# EAGLE design FunctionGenerator (EAGLE 5.10)

## Sheet 1 of 5
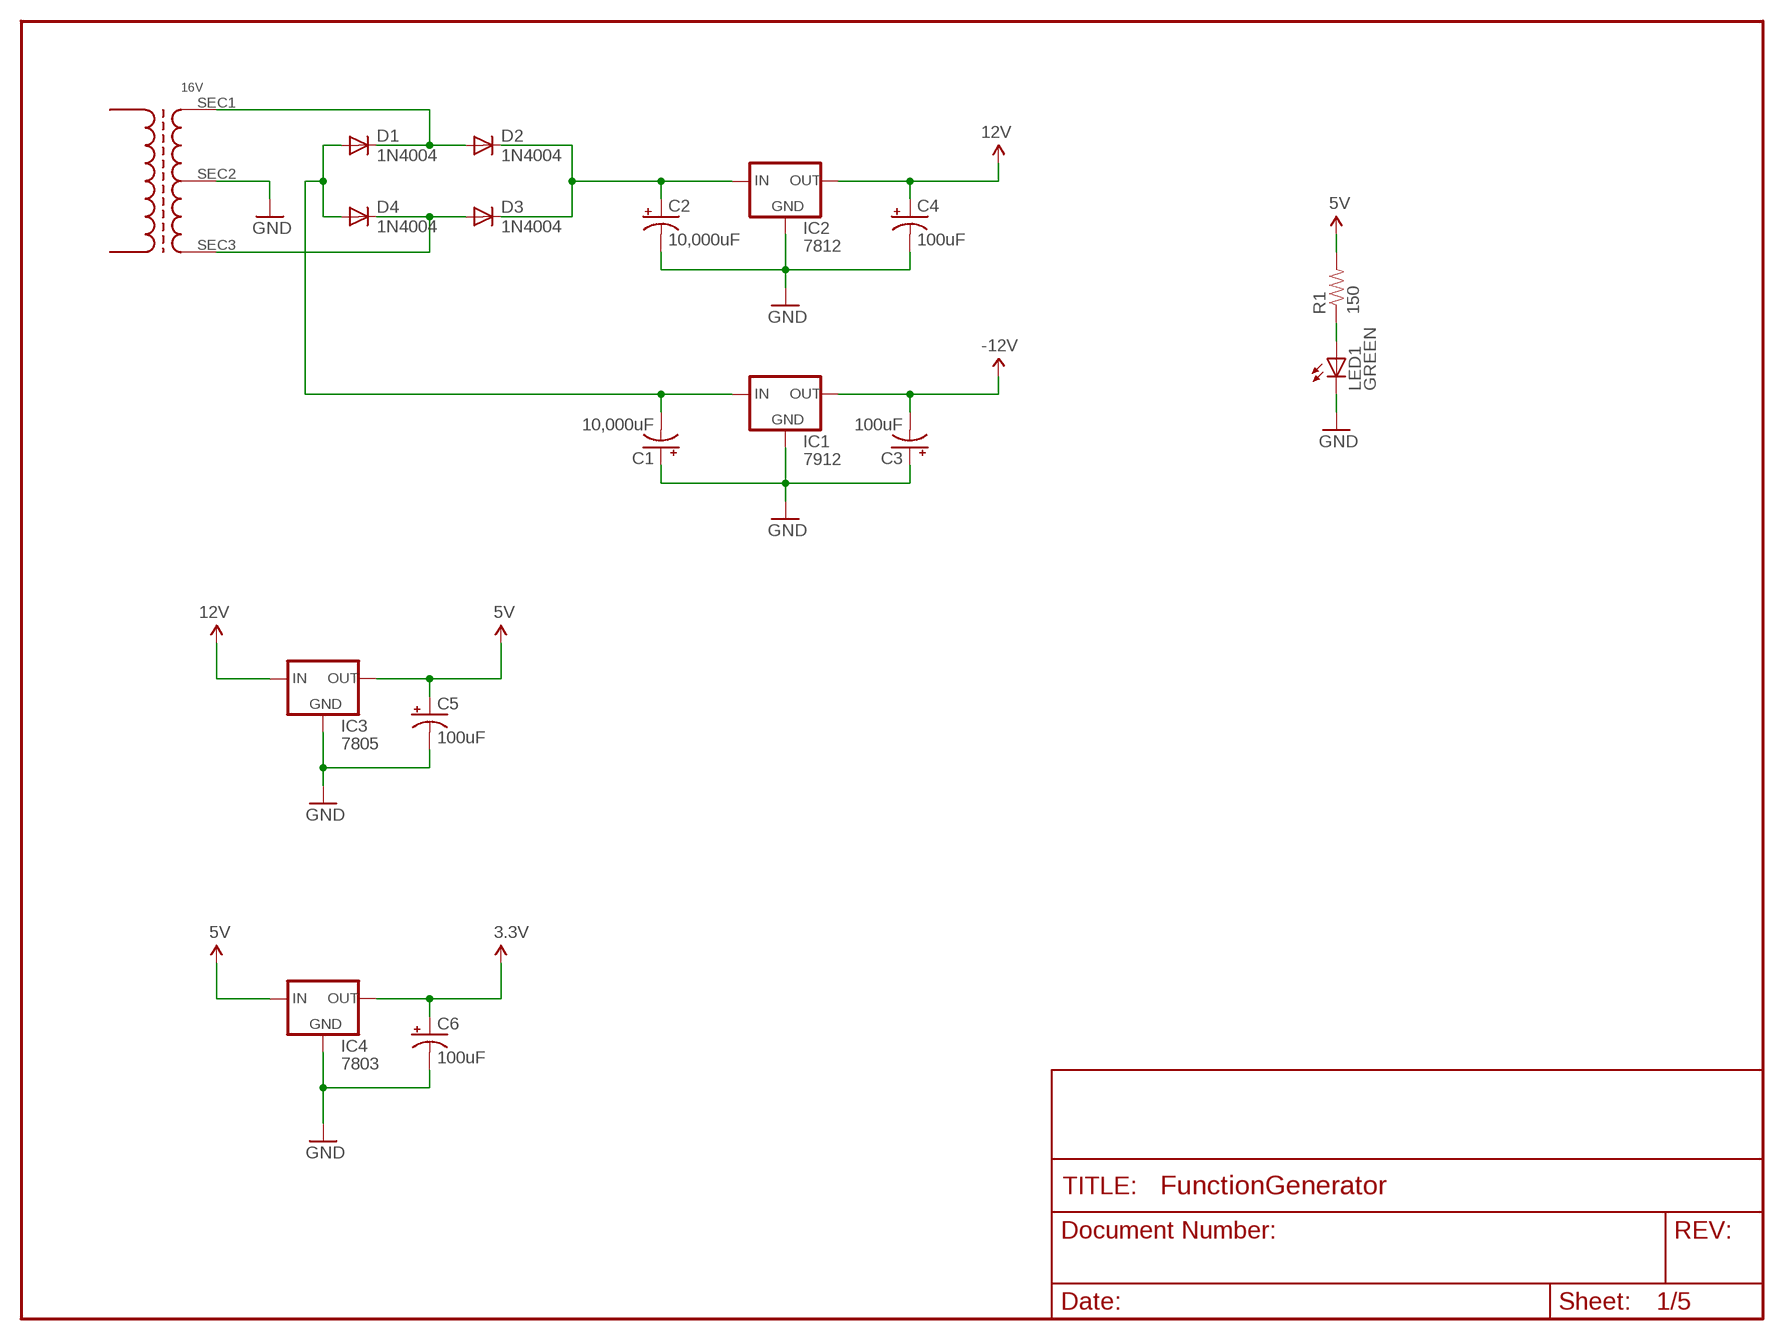
[diagram p0: schematic, sheet 1]

### Parts
C1  10,000uF  CAP_POLPTH4  [CPOL-RADIAL-1000UF-25V]
C2  10,000uF  CAP_POLPTH4  [CPOL-RADIAL-1000UF-25V]
C3  100uF  CAP_POLPTH1  [CPOL-RADIAL-100UF-25V]
C4  100uF  CAP_POLPTH1  [CPOL-RADIAL-100UF-25V]
C5  100uF  CAP_POLPTH1  [CPOL-RADIAL-100UF-25V]
C6  100uF  CAP_POLPTH1  [CPOL-RADIAL-100UF-25V]
D1  1N4004  [DO41-10]
D2  1N4004  [DO41-10]
D3  1N4004  [DO41-10]
D4  1N4004  [DO41-10]
IC1  7912  V_REG_78XXSINK  [TO220-IGO]
IC2  7812  V_REG_78XXSINK  [TO220-IGO]
IC3  7805  V_REG_78XXSINK  [TO220-IGO]
IC4  7803  V_REG_78XXSINK  [TO220-IGO]
LED1  GREEN  LED1206  [LED-1206]
R1  150  RESISTOR1206  [1206]
T1  16V  TRANSFORMER-CENTERTAP  [TRANSFORMER-CENTERTAP-WIRE]

### Nets
3.3V: C6.1(+) IC4.OUT ; also sheet 2,3,5
5V: C5.1(+) IC3.OUT IC4.IN R1.2
12V: C4.1(+) IC2.OUT IC3.IN ; also sheet 3
-12V: C3.2(-) IC1.OUT ; also sheet 3
GND: C1.1(+) C2.2(-) C3.1(+) C4.2(-) C5.2(-) C6.2(-) IC1.GND IC2.GND IC3.GND IC4.GND LED1.C T1.SEC2 ; also sheet 2,3,4,5
N$1: C1.2(-) D1.A D4.A IC1.IN
N$2: D1.C D2.A T1.SEC1
N$3: D3.A D4.C T1.SEC3
N$4: C2.1(+) D2.C D3.C IC2.IN
N$6: LED1.A R1.1

## Sheet 2 of 5
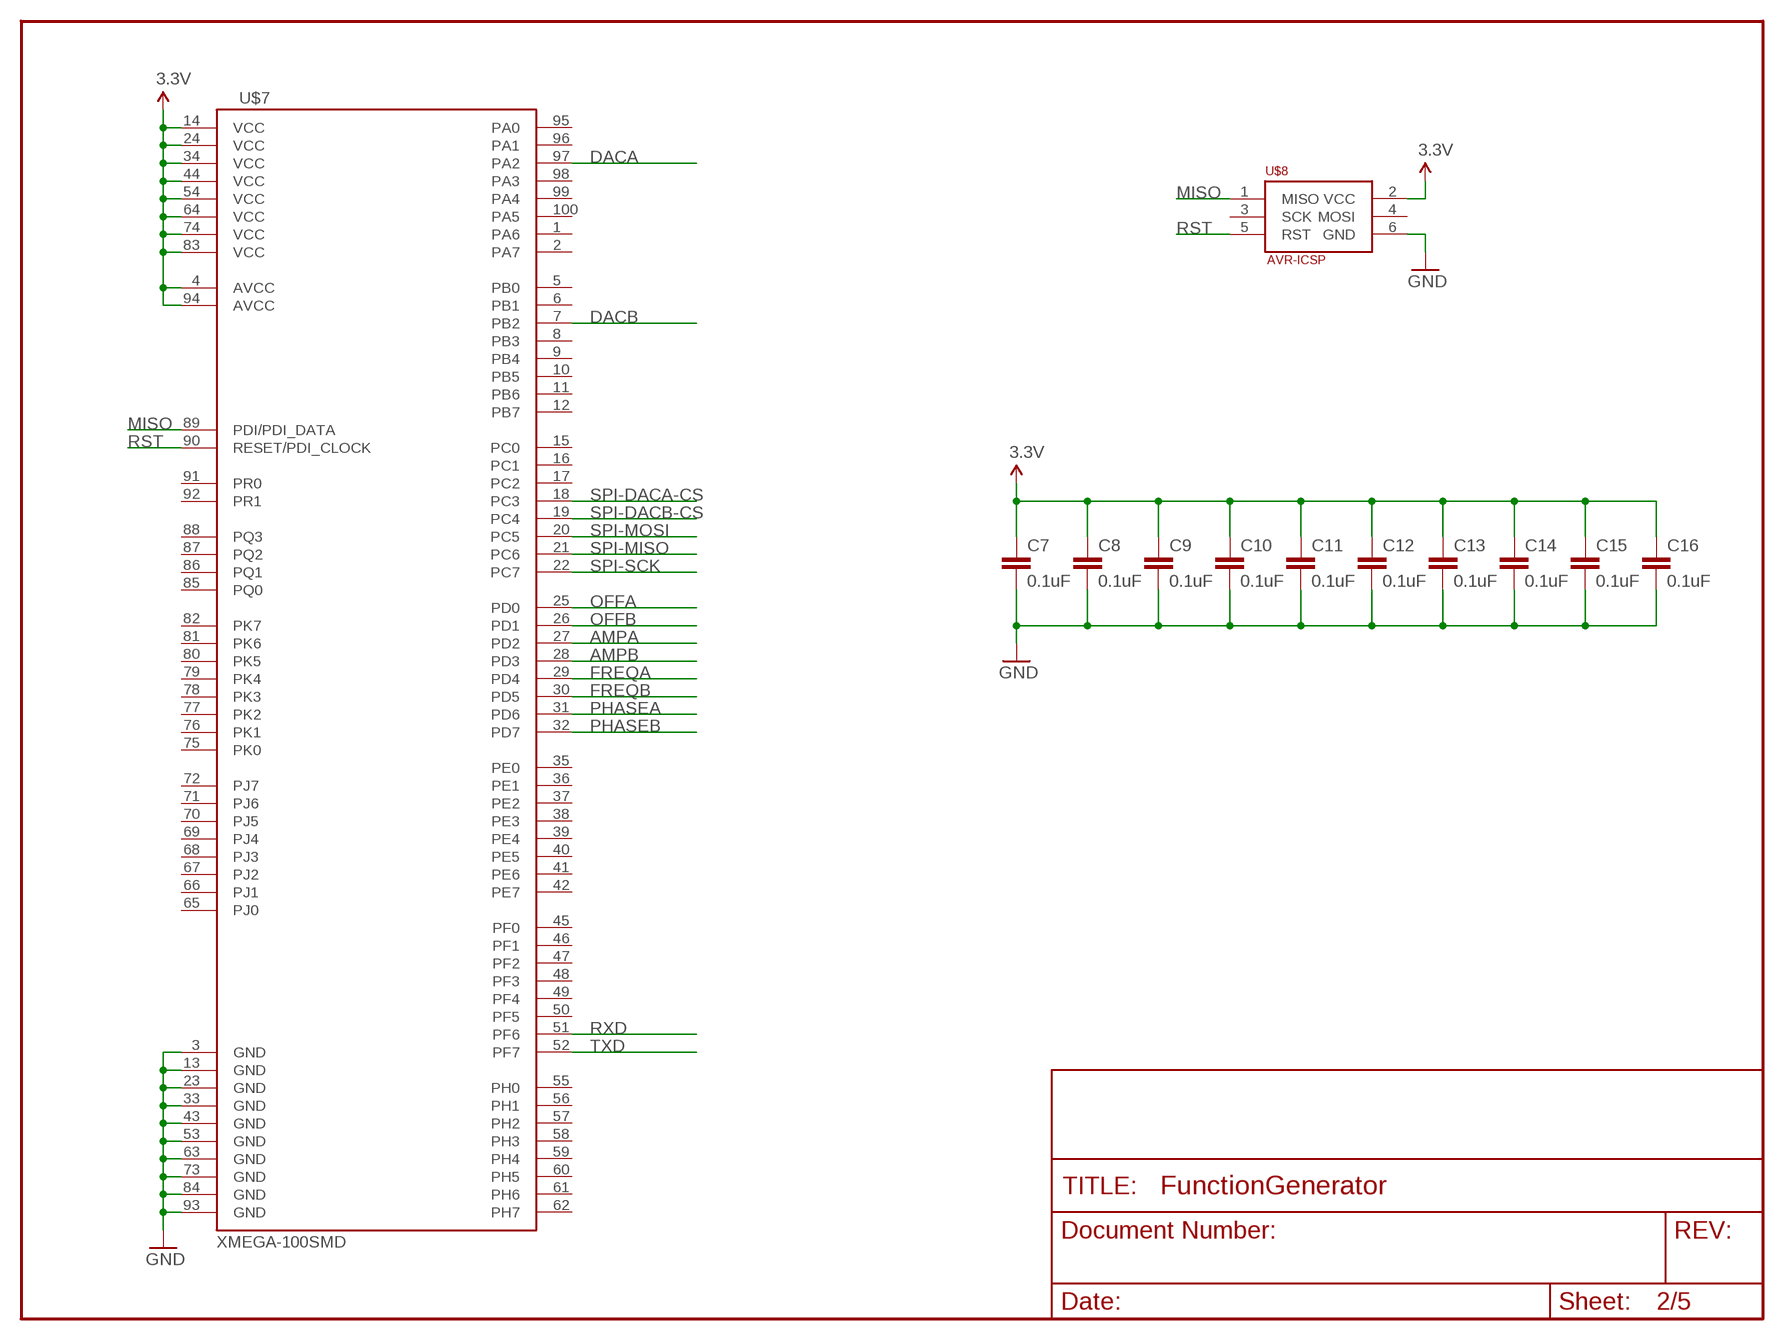
[diagram p1: schematic, sheet 2]

### Parts
C7  0.1uF  CAP0805  [0805]
C8  0.1uF  CAP0805  [0805]
C9  0.1uF  CAP0805  [0805]
C10  0.1uF  CAP0805  [0805]
C11  0.1uF  CAP0805  [0805]
C12  0.1uF  CAP0805  [0805]
C13  0.1uF  CAP0805  [0805]
C14  0.1uF  CAP0805  [0805]
C15  0.1uF  CAP0805  [0805]
C16  0.1uF  CAP0805  [0805]
U$7  XMEGA-100SMD  [TQFP-100-14X14MM]
U$8  AVR-ICSP  [AVR-ICSP]

### Nets
3.3V: C7.1 C8.1 C9.1 C10.1 C11.1 C12.1 C13.1 C14.1 C15.1 C16.1 U$7.4(AVCC) U$7.14(VCC) U$7.24(VCC) U$7.34(VCC) U$7.44(VCC) U$7.54(VCC) U$7.64(VCC) U$7.74(VCC) U$7.83(VCC) U$7.94(AVCC) U$8.2(VCC) ; also sheet 1,3,5
AMPA: U$7.27(PD2) ; also sheet 5
AMPB: U$7.28(PD3) ; also sheet 5
DACA: U$7.97(PA2) ; also sheet 3
DACB: U$7.7(PB2) ; also sheet 3
FREQA: U$7.29(PD4) ; also sheet 5
FREQB: U$7.30(PD5) ; also sheet 5
GND: C7.2 C8.2 C9.2 C10.2 C11.2 C12.2 C13.2 C14.2 C15.2 C16.2 U$7.3(GND) U$7.13(GND) U$7.23(GND) U$7.33(GND) U$7.43(GND) U$7.53(GND) U$7.63(GND) U$7.73(GND) U$7.84(GND) U$7.93(GND) U$8.6(GND) ; also sheet 1,3,4,5
MISO: U$7.89(PDI/PDI_DATA) U$8.1(MISO)
OFFA: U$7.25(PD0) ; also sheet 5
OFFB: U$7.26(PD1) ; also sheet 5
PHASEA: U$7.31(PD6) ; also sheet 5
PHASEB: U$7.32(PD7) ; also sheet 5
RST: U$7.90(RESET/PDI_CLOCK) U$8.5(RST)
RXD: U$7.51(PF6) ; also sheet 4
SPI-DACA-CS: U$7.18(PC3) ; also sheet 3
SPI-DACB-CS: U$7.19(PC4) ; also sheet 3
SPI-MISO: U$7.21(PC6) ; also sheet 3
SPI-MOSI: U$7.20(PC5) ; also sheet 3
SPI-SCK: U$7.22(PC7) ; also sheet 3
TXD: U$7.52(PF7) ; also sheet 4
Unconnected: U$7.1(PA6) U$7.2(PA7) U$7.5(PB0) U$7.6(PB1) U$7.8(PB3) U$7.9(PB4) U$7.10(PB5) U$7.11(PB6) U$7.12(PB7) U$7.15(PC0) U$7.16(PC1) U$7.17(PC2) U$7.35(PE0) U$7.36(PE1) U$7.37(PE2) U$7.38(PE3) U$7.39(PE4) U$7.40(PE5) U$7.41(PE6) U$7.42(PE7) U$7.45(PF0) U$7.46(PF1) U$7.47(PF2) U$7.48(PF3) U$7.49(PF4) U$7.50(PF5) U$7.55(PH0) U$7.56(PH1) U$7.57(PH2) U$7.58(PH3) U$7.59(PH4) U$7.60(PH5) U$7.61(PH6) U$7.62(PH7) U$7.65(PJ0) U$7.66(PJ1) U$7.67(PJ2) U$7.68(PJ3) U$7.69(PJ4) U$7.70(PJ5) U$7.71(PJ6) U$7.72(PJ7) U$7.75(PK0) U$7.76(PK1) U$7.77(PK2) U$7.78(PK3) U$7.79(PK4) U$7.80(PK5) U$7.81(PK6) U$7.82(PK7) U$7.85(PQ0) U$7.86(PQ1) U$7.87(PQ2) U$7.88(PQ3) U$7.91(PR0) U$7.92(PR1) U$7.95(PA0) U$7.96(PA1) U$7.98(PA3) U$7.99(PA4) U$7.100(PA5) U$8.3(SCK) U$8.4(MOSI)

## Sheet 3 of 5
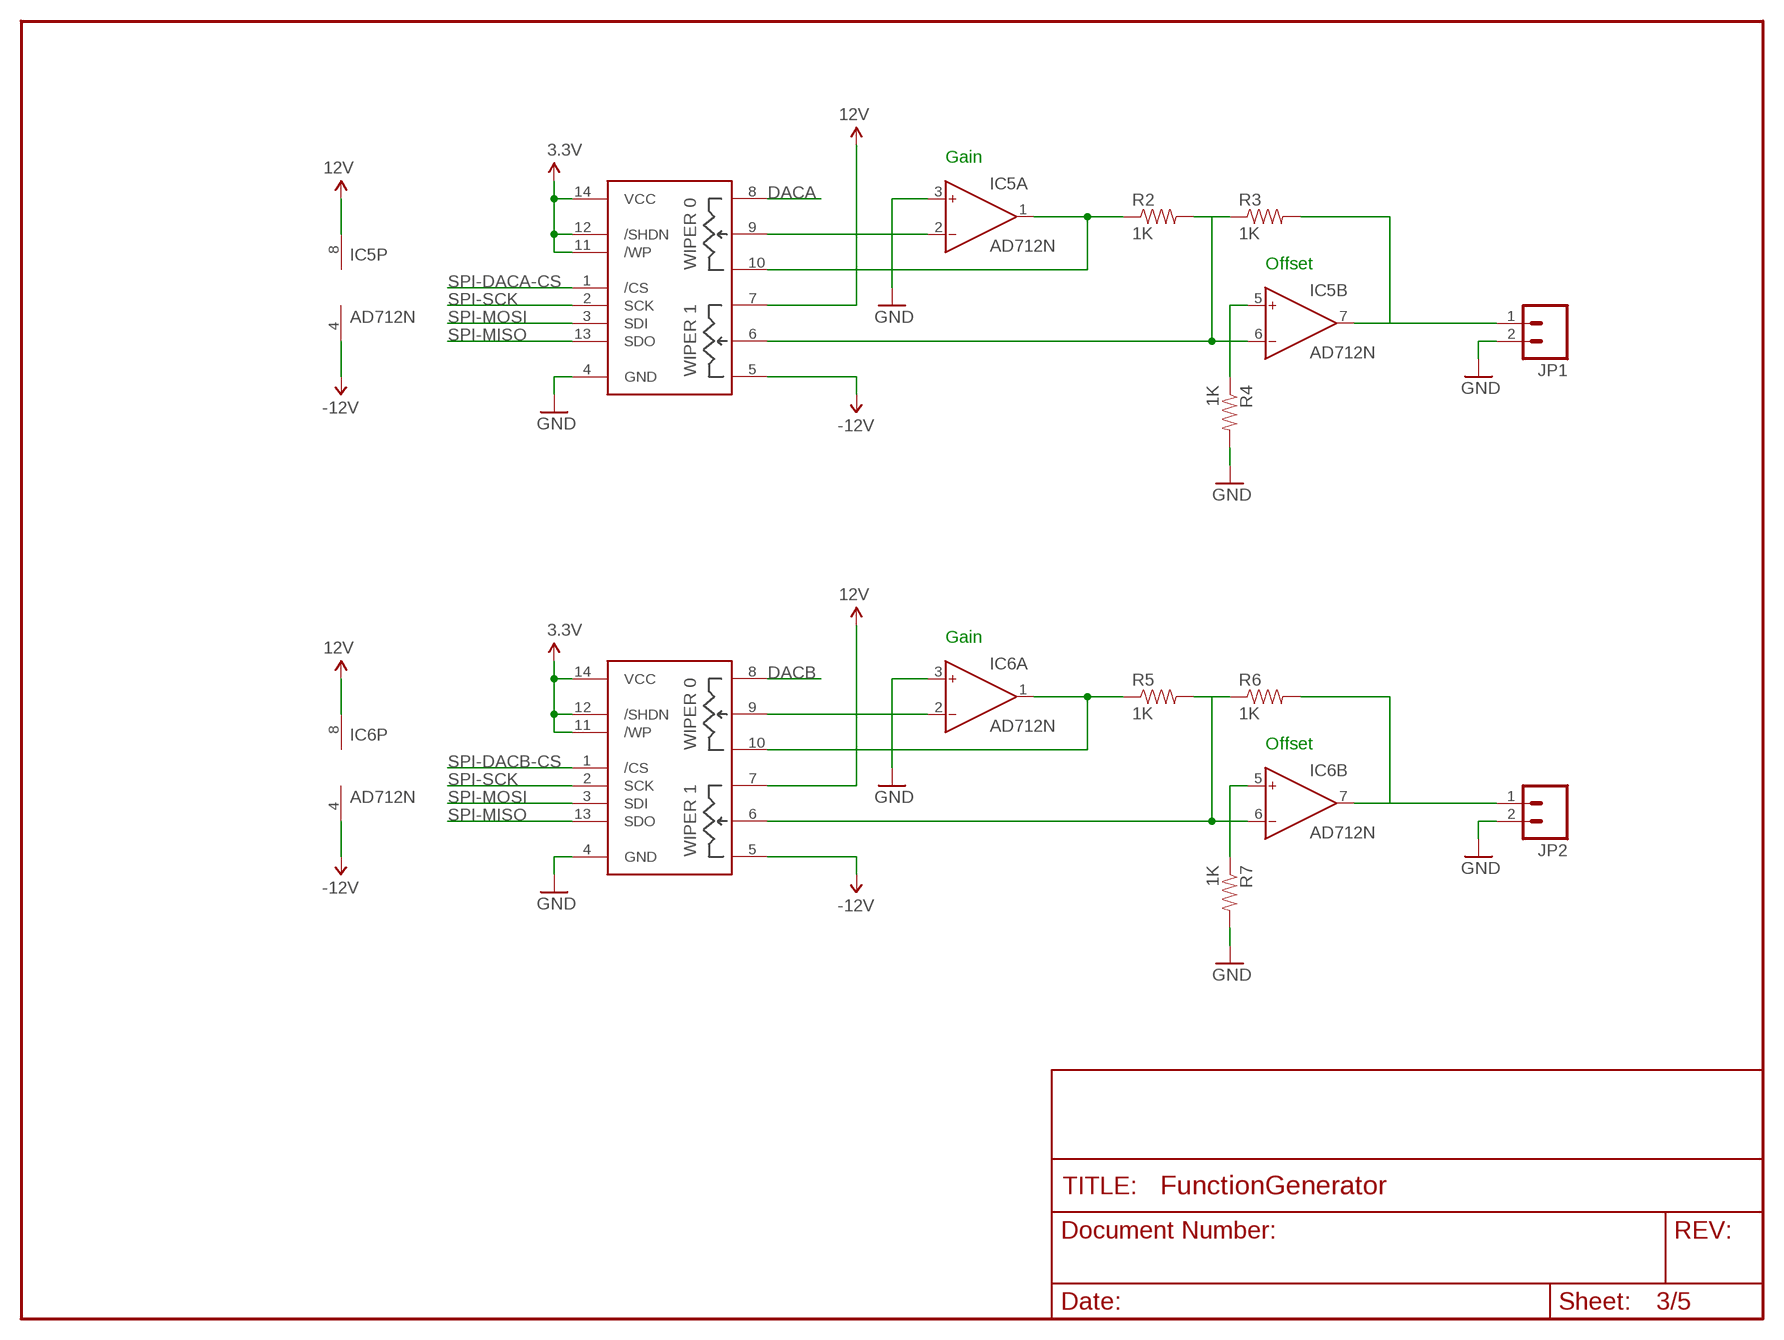
[diagram p2: schematic, sheet 3]

### Parts
IC5  AD712N  [DIL08]
IC6  AD712N  [DIL08]
JP1  M02PTH  [1X02]
JP2  M02PTH  [1X02]
R2  1K  RESISTOR1206  [1206]
R3  1K  RESISTOR1206  [1206]
R4  1K  RESISTOR1206  [1206]
R5  1K  RESISTOR1206  [1206]
R6  1K  RESISTOR1206  [1206]
R7  1K  RESISTOR1206  [1206]
U1  MCP42X1  [DIL14]
U2  MCP42X1  [DIL14]

### Nets
3.3V: U1.11(/WP) U1.12(/SHDN) U1.14(VCC) U2.11(/WP) U2.12(/SHDN) U2.14(VCC) ; also sheet 1,2,5
12V: IC5.8(P:V+) IC6.8(P:V+) U1.7(P1A) U2.7(P1A) ; also sheet 1
-12V: IC5.4(P:V-) IC6.4(P:V-) U1.5(P1B) U2.5(P1B) ; also sheet 1
DACA: U1.8(P0A) ; also sheet 2
DACB: U2.8(P0A) ; also sheet 2
GND: IC5.3(A:IN+) IC6.3(A:IN+) JP1.2 JP2.2 R4.2 R7.2 U1.4(GND) U2.4(GND) ; also sheet 1,2,4,5
N$7: IC5.2(A:IN-) U1.9(P0W)
N$8: IC5.6(B:IN-) R2.2 R3.1 U1.6(P1W)
N$9: IC5.1(A:OUT) R2.1 U1.10(P0B)
N$10: IC6.2(A:IN-) U2.9(P0W)
N$11: IC6.1(A:OUT) R5.1 U2.10(P0B)
N$12: R3.2
N$13: IC5.7(B:OUT) JP1.1
N$14: IC5.5(B:IN+) R4.1
N$15: IC6.6(B:IN-) R5.2 R6.1 U2.6(P1W)
N$16: R6.2
N$17: IC6.7(B:OUT) JP2.1
N$18: IC6.5(B:IN+) R7.1
SPI-DACA-CS: U1.1(/CS) ; also sheet 2
SPI-DACB-CS: U2.1(/CS) ; also sheet 2
SPI-MISO: U1.13(SDO) U2.13(SDO) ; also sheet 2
SPI-MOSI: U1.3(SDI) U2.3(SDI) ; also sheet 2
SPI-SCK: U1.2(SCK) U2.2(SCK) ; also sheet 2

### Notes on the sheet
- Gain
- Offset
- Gain
- Offset

## Sheet 4 of 5
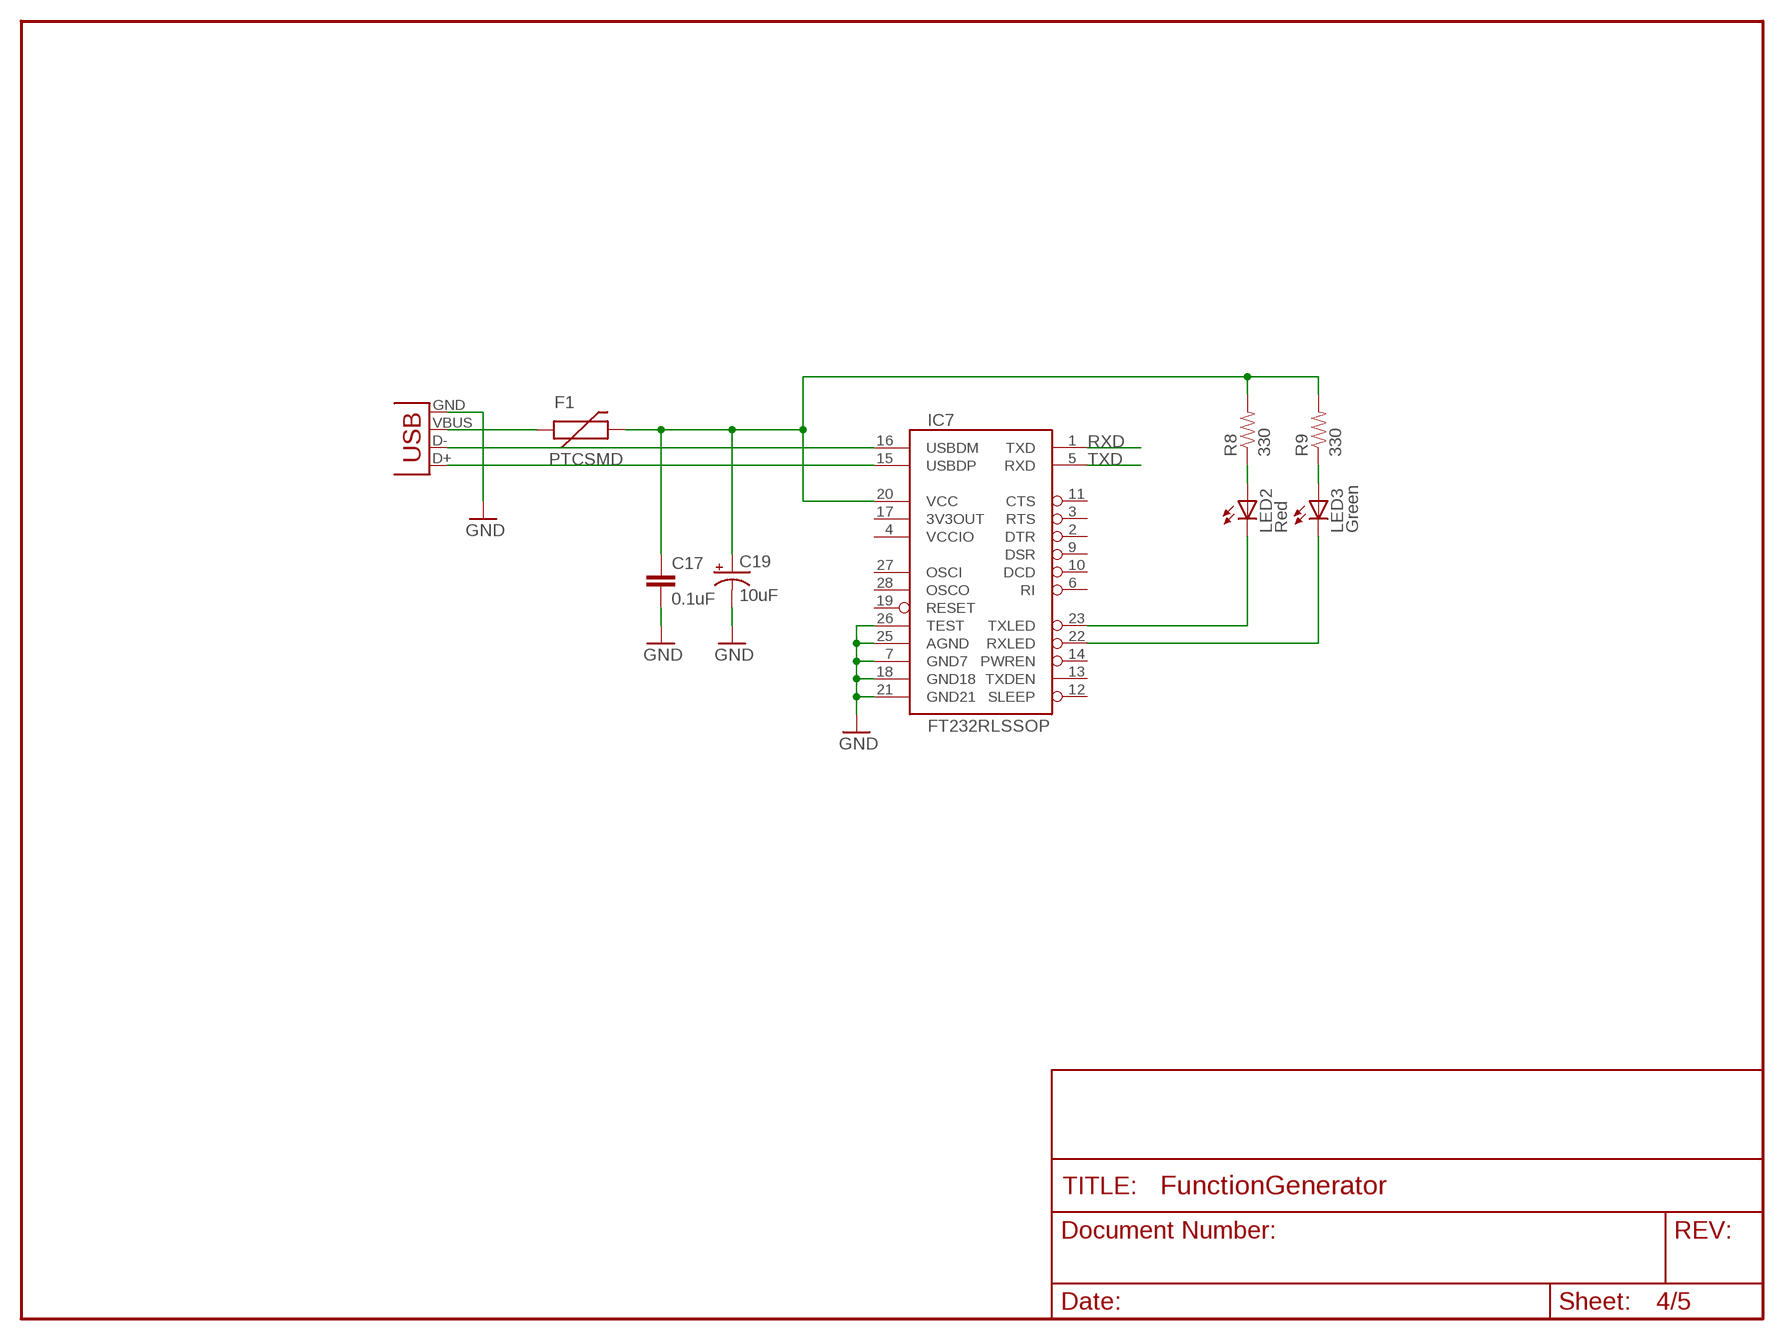
[diagram p3: schematic, sheet 4]

### Parts
C17  0.1uF  CAP1206  [1206]
C19  10uF  CAP_POL1206  [EIA3216]
F1  PTCSMD  [PTC-1206]
IC7  FT232RLSSOP  [SSOP28DB]
LED2  Red  LED1206  [LED-1206]
LED3  Green  LED1206  [LED-1206]
R8  330  RESISTOR1206  [1206]
R9  330  RESISTOR1206  [1206]
X1  USBSMD  [USB-MINIB]

### Nets
GND: C17.2 C19.C(-) IC7.7(GND7) IC7.18(GND18) IC7.21(GND21) IC7.25(AGND) IC7.26(TEST) X1.GND ; also sheet 1,2,3,5
N$5: F1.1 X1.VBUS
N$19: IC7.16(USBDM) X1.D-
N$20: IC7.15(USBDP) X1.D+
N$21: C17.1 C19.A(+) F1.2 IC7.20(VCC) R8.2 R9.2
N$22: LED2.A R8.1
N$23: LED3.A R9.1
N$24: IC7.23(TXLED) LED2.C
N$25: IC7.22(RXLED) LED3.C
RXD: IC7.1(TXD) ; also sheet 2
TXD: IC7.5(RXD) ; also sheet 2
Unconnected: IC7.2(DTR) IC7.3(RTS) IC7.6(RI) IC7.9(DSR) IC7.10(DCD) IC7.11(CTS) IC7.12(SLEEP) IC7.13(TXDEN) IC7.14(PWREN) IC7.17(3V3OUT) IC7.19(RESET) IC7.27(OSCI) IC7.28(OSCO)

## Sheet 5 of 5
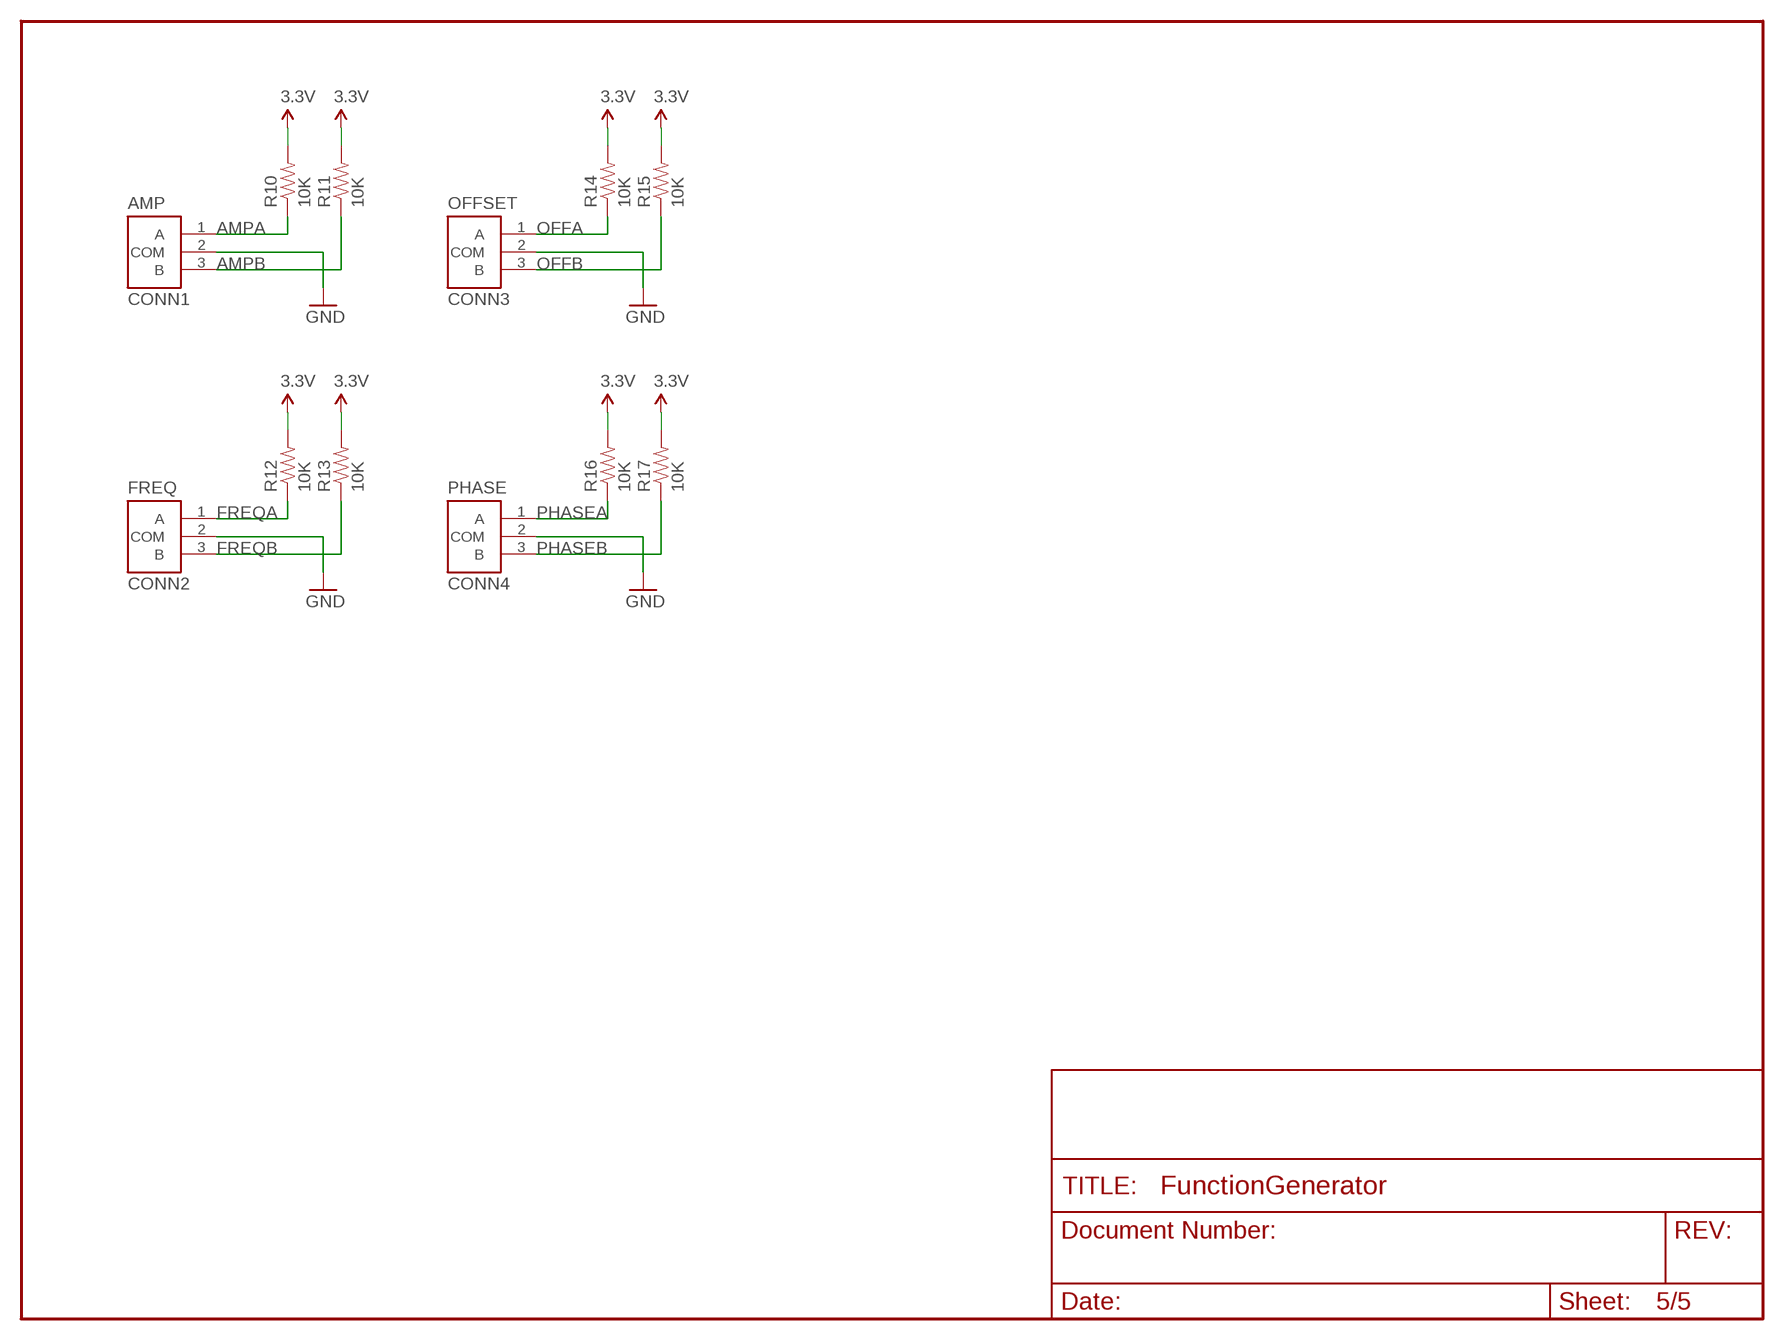
[diagram p4: schematic, sheet 5]

### Parts
CONN1  AMP  ENCODER  [1X03]
CONN2  FREQ  ENCODER  [1X03]
CONN3  OFFSET  ENCODER  [1X03]
CONN4  PHASE  ENCODER  [1X03]
R10  10K  RESISTOR1206  [1206]
R11  10K  RESISTOR1206  [1206]
R12  10K  RESISTOR1206  [1206]
R13  10K  RESISTOR1206  [1206]
R14  10K  RESISTOR1206  [1206]
R15  10K  RESISTOR1206  [1206]
R16  10K  RESISTOR1206  [1206]
R17  10K  RESISTOR1206  [1206]

### Nets
3.3V: R10.2 R11.2 R12.2 R13.2 R14.2 R15.2 R16.2 R17.2 ; also sheet 1,2,3
AMPA: CONN1.1(A) R10.1 ; also sheet 2
AMPB: CONN1.3(B) R11.1 ; also sheet 2
FREQA: CONN2.1(A) R12.1 ; also sheet 2
FREQB: CONN2.3(B) R13.1 ; also sheet 2
GND: CONN1.2(COM) CONN2.2(COM) CONN3.2(COM) CONN4.2(COM) ; also sheet 1,2,3,4
OFFA: CONN3.1(A) R14.1 ; also sheet 2
OFFB: CONN3.3(B) R15.1 ; also sheet 2
PHASEA: CONN4.1(A) R16.1 ; also sheet 2
PHASEB: CONN4.3(B) R17.1 ; also sheet 2

## Power pins joined to a net without a drawn wire
VCCIO: IC7.4(VCCIO)

## Library data of the parts
C1-C6 C19 = SparkFun:CAP_POL: Capacitor Polarized These are standard SMD and PTH capacitors. Normally 10uF, 47uF, and 100uF in electrolytic and tantalum varieties. Always verify the external diameter of the through hole cap, it varies with capacity, voltage, and manufacturer. The EIA devices should be standard.
C7-C17 = SparkFun:CAP: Capacitor Standard 0603 ceramic capacitor, and 0.1" leaded capacitor.
CONN1-CONN4 = FiveVolt:ENCODER: Rotary Encoder
D1-D4 = diode:1N4004: DIODE general purpose rectifier, 1 A
F1 = SparkFun:PTC: Resettable Fuse PTC Resettable Fuse. Spark Fun Electronics SKU : COM-08357
IC1-IC4 = SparkFun:V_REG_78XX: Voltage Regulator Standard 7805 5V regulator. IGO (Input Ground Output). Spark Fun Electronics SKU : COM-00107
IC5 IC6 = analog-devices:AD712: Dual Precision, Low Cost, High Speed BiFET Op Amp Source: http://www.analog.com/static/imported-files/data_sheets/AD712.pdf
IC7 = SparkFun:FT232RL: USB UART FT232RL 4th Generation USB UART (USB <-> Serial) Controller. Spark Fun Electronics SKU : COM-00650
JP1 JP2 = SparkFun:M02: Header 2 Standard 2-pin 0.1" header. Use with straight break away headers (SKU : PRT-00116), right angle break away headers (PRT-00553), swiss pins (PRT-00743), machine pins (PRT-00117), and female headers (PRT-00115). Molex polarized connector foot print use with SKU : PRT-08233 with associated crimp pins and housings.
LED1-LED3 = SparkFun:LED: LEDs Standard schematic elements and footprints for 5mm, 3mm, 1206, and 0603 sized LEDs. 5mm - Spark Fun Electronics SKU : COM-00529 (and others)
R1-R17 = SparkFun:RESISTOR: Resistor Basic schematic elements and footprints for 0603, 1206, and PTH 1/10th watt (small) resistors.
T1 = FiveVolt:TRANSFORMER-CENTERTAP
U1 U2 = FiveVolt:MCP42X1: Dual Potentiometers
U$7 = SparkFun:XMEGA-100
U$8 = FiveVolt:AVR-ICSP
X1 = SparkFun:USB: USB Connectors USB-B-PTH is fully proven SKU : PRT-00139 USB-miniB is fully proven SKU : PRT-00587 USB-A-PCB is untested. USB-A-H is throughly reviewed, but untested. Spark Fun Electronics SKU : PRT-00437 USB-B-SMT is throughly reviewed, but untested. Needs silkscreen touching up. USB-A-S has not been used/tested USB-MB-H has not been used/tested

## Board
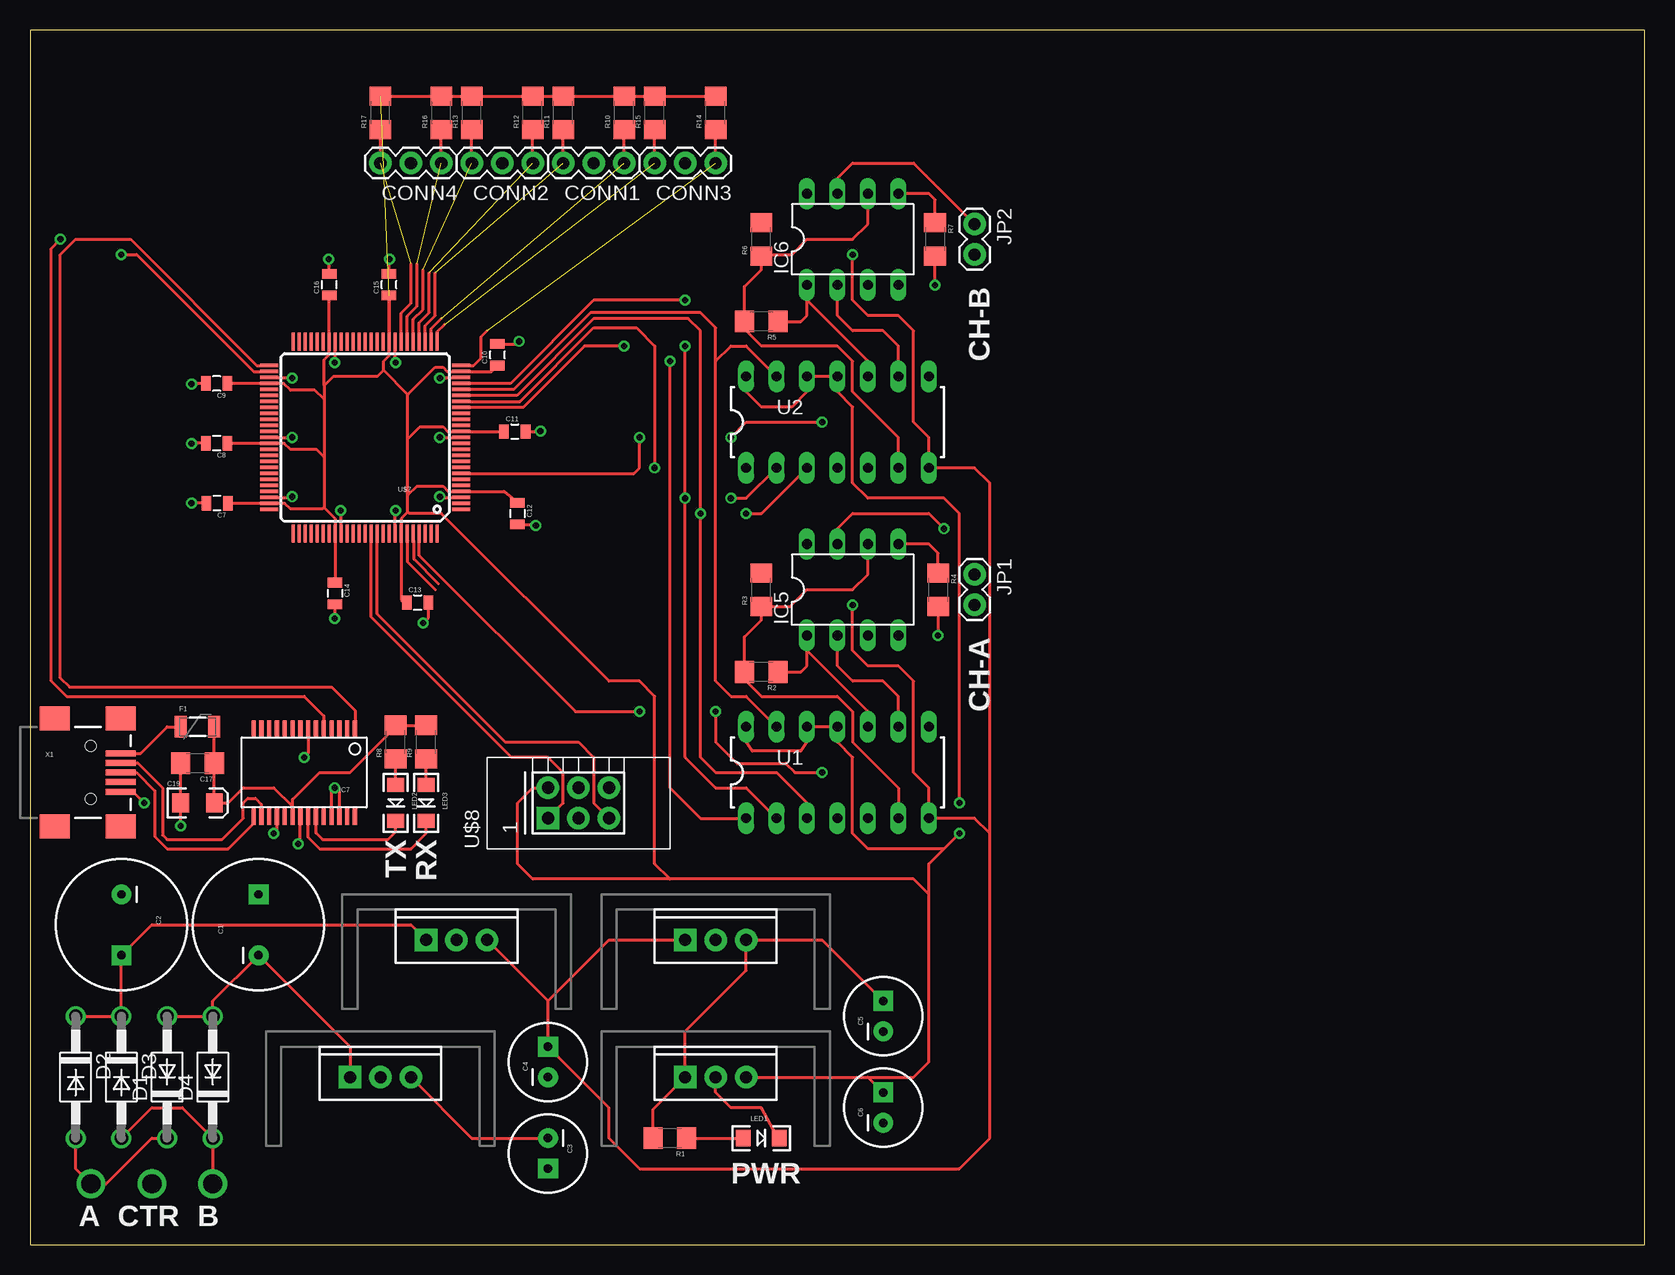
[diagram p5: board, top side]
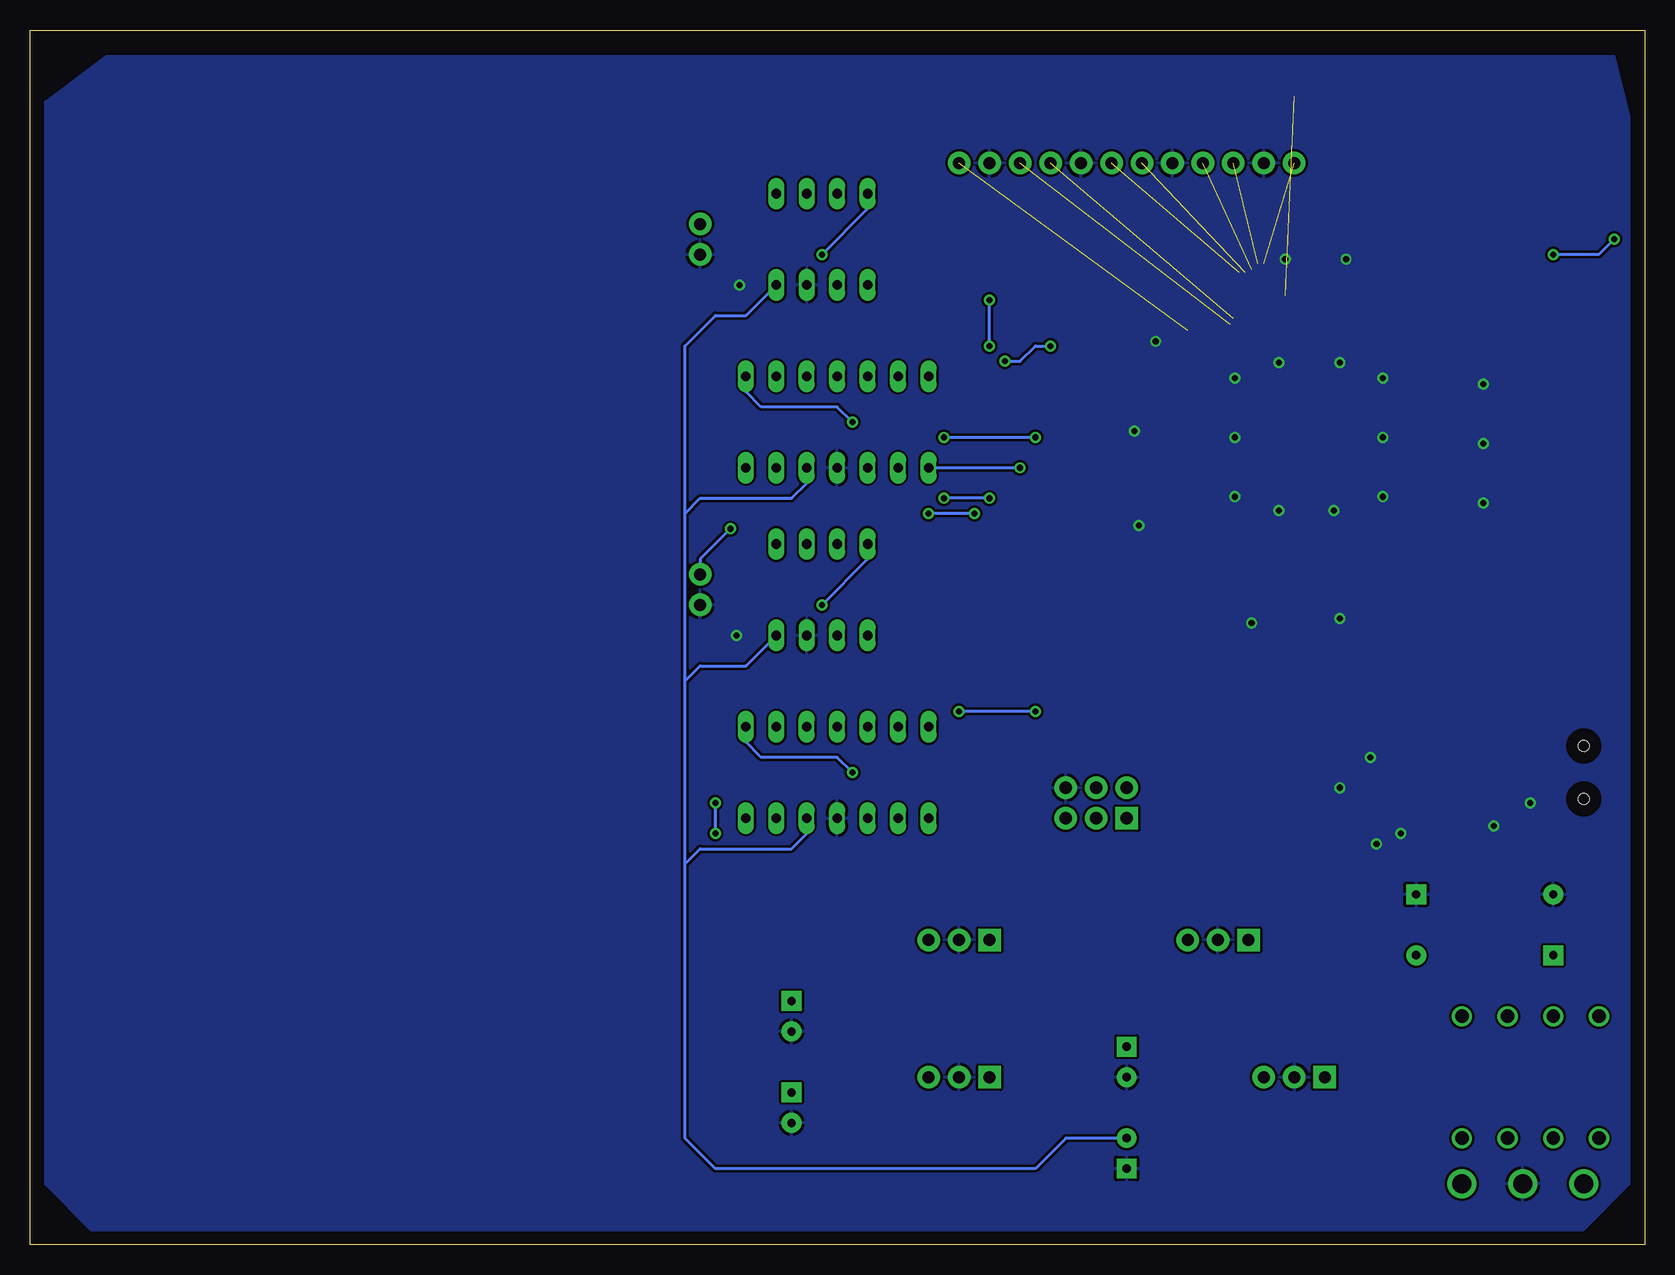
[diagram p6: board, bottom side, seen from below]

Size 134.6 x 101.27 mm. Coordinates in mm from the lower left corner, seen from the top.
Outline: 0,0 134.6,0 134.6,101.27 0,101.27 0,0
Copper layers (1*16): Top 0.035mm / dielectric 1.5mm / Bottom 0.035mm
Design rules "default": minimum track width 10mil, minimum drill 24mil, track to track 8mil, track to pad 8mil, pad to pad 8mil, via to via 8mil, smd to smd 8mil, copper to edge 40mil, drill to drill 8mil, minimum pad ring 10mil, minimum via ring 8mil, stop-mask expansion 4mil, vias tented up to drill 0mil, thermal gap 10mil

### Footprints (pad centres in the part's own frame; a part is rotated, then mirrored left to right if it is on the bottom)
CPOL-RADIAL-1000UF-25V = drill 0.7 pad 1.651 square: 1 2.54,0 | drill 0.7 pad 1.651 round: 2 -2.54,0
CPOL-RADIAL-100UF-25V = drill 0.7 pad 1.651 square: 1 1.27,0 | drill 0.7 pad 1.651 round: 2 -1.27,0
0805 = smd 0.8 x 1.2: 1 -0.9,0; 2 0.9,0
1206 = smd 1.6 x 1.8: 1 -1.4,0; 2 1.4,0
EIA3216 = smd 1.4 x 1.6: A 1.4,0; C -1.4,0
1X03 = drill 1.016 pad 1.88 round: 1 -2.54,0; 2 0,0; 3 2.54,0
DO41-10 = drill 1.118 round: A 5.08,0; C -5.08,0
PTC-1206 = smd 1 x 1.8: 1 -1.4,0; 2 1.4,0
TO220-IGO = drill 1 pad 1.88 round: GND 0,0; OUT 2.54,0 | drill 1 pad 1.88 square: IN -2.54,0
DIL08 = drill 0.813 long: 1 -3.81,-3.81; 2 -1.27,-3.81; 3 1.27,-3.81; 4 3.81,-3.81; 5 3.81,3.81; 6 1.27,3.81; 7 -1.27,3.81; 8 -3.81,3.81
SSOP28DB = smd 0.348 x 1.397: 1 -4.225,-3.656; 2 -3.575,-3.656; 3 -2.925,-3.656; 4 -2.275,-3.656; 5 -1.625,-3.656; 6 -0.975,-3.656; 7 -0.325,-3.656; 8 0.325,-3.656; 9 0.975,-3.656; 10 1.625,-3.656; 11 2.275,-3.656; 12 2.925,-3.656; 13 3.575,-3.656; 14 4.225,-3.656; 15 4.225,3.656; 16 3.575,3.656; 17 2.925,3.656; 18 2.275,3.656; 19 1.625,3.656; 20 0.975,3.656; 21 0.325,3.656; 22 -0.325,3.656; 23 -0.975,3.656; 24 -1.625,3.656; 25 -2.275,3.656; 26 -2.925,3.656; 27 -3.575,3.656; 28 -4.225,3.656
1X02 = drill 1.016 pad 1.88 round: 1 0,0; 2 2.54,0
LED-1206 = smd 1.2 x 1.4: A -1.5,0; C 1.5,0
TRANSFORMER-CENTERTAP-WIRE = drill 1.6 round: SEC1 0,5.08; SEC2 0,0; SEC3 0,-5.08
DIL14 = drill 0.813 long: 1 -7.62,-3.81; 2 -5.08,-3.81; 3 -2.54,-3.81; 4 0,-3.81; 5 2.54,-3.81; 6 5.08,-3.81; 7 7.62,-3.81; 8 7.62,3.81; 9 5.08,3.81; 10 2.54,3.81; 11 0,3.81; 12 -2.54,3.81; 13 -5.08,3.81; 14 -7.62,3.81
TQFP-100-14X14MM = smd 1.5 x 0.27: 1 -8,6; 2 -8,5.5; 3 -8,5; 4 -8,4.5; 5 -8,4; 6 -8,3.5; 7 -8,3; 8 -8,2.5; 9 -8,2; 10 -8,1.5; 11 -8,1; 12 -8,0.5; 13 -8,0; 14 -8,-0.5; 15 -8,-1; 16 -8,-1.5; 17 -8,-2; 18 -8,-2.5; 19 -8,-3; 20 -8,-3.5; 21 -8,-4; 22 -8,-4.5; 23 -8,-5; 24 -8,-5.5; 25 -8,-6; 51 8,-6; 52 8,-5.5; 53 8,-5; 54 8,-4.5; 55 8,-4; 56 8,-3.5; 57 8,-3; 58 8,-2.5; 59 8,-2; 60 8,-1.5; 61 8,-1; 62 8,-0.5; 63 8,0; 64 8,0.5; 65 8,1; 66 8,1.5; 67 8,2; 68 8,2.5; 69 8,3; 70 8,3.5; 71 8,4; 72 8,4.5; 73 8,5; 74 8,5.5; 75 8,6 | smd 0.27 x 1.5: 26 -6,-8; 27 -5.5,-8; 28 -5,-8; 29 -4.5,-8; 30 -4,-8; 31 -3.5,-8; 32 -3,-8; 33 -2.5,-8; 34 -2,-8; 35 -1.5,-8; 36 -1,-8; 37 -0.5,-8; 38 0,-8; 39 0.5,-8; 40 1,-8; 41 1.5,-8; 42 2,-8; 43 2.5,-8; 44 3,-8; 45 3.5,-8; 46 4,-8; 47 4.5,-8; 48 5,-8; 49 5.5,-8; 50 6,-8; 76 6,8; 77 5.5,8; 78 5,8; 79 4.5,8; 80 4,8; 81 3.5,8; 82 3,8; 83 2.5,8; 84 2,8; 85 1.5,8; 86 1,8; 87 0.5,8; 88 0,8; 89 -0.5,8; 90 -1,8; 91 -1.5,8; 92 -2,8; 93 -2.5,8; 94 -3,8; 95 -3.5,8; 96 -4,8; 97 -4.5,8; 98 -5,8; 99 -5.5,8; 100 -6,8
AVR-ICSP = drill 1.016 pad 1.88 square: 1 -1.27,2.54 | drill 1.016 pad 1.88 round: 2 1.27,2.54; 3 -1.27,0; 4 1.27,0; 5 -1.27,-2.54; 6 1.27,-2.54
USB-MINIB = smd 2.5 x 0.5: D+ 2.5,0; D- 2.5,0.8; GND 2.5,-1.6; ID 2.5,-0.8; VBUS 2.5,1.6 | smd 2.5 x 2: GND@1 -3,-4.5; GND@2 -3,4.5; GND@3 2.5,4.5; GND@4 2.5,-4.5 | hole 0.9: 0,2.2; 0,-2.2

### Placement (x,y rotation side)
C1  19.05,26.67 90 top
C2  7.62,26.67 270 top
C3  43.18,7.62 270 top
C4  43.18,15.24 90 top
C5  71.12,19.05 90 top
C6  71.12,11.43 90 top
C7  15.6,61.82 180 top
C8  15.57,66.83 180 top
C9  15.57,71.81 180 top
C10  38.96,74.19 90 top
C11  40.41,67.79 0 top
C12  40.64,60.96 270 top
C13  32.31,53.54 0 top
C14  25.43,54.31 270 top
C15  29.92,80.04 90 top
C16  24.94,80.04 90 top
C17  13.97,40.13 180 top
C19  13.97,36.83 0 top
CONN1  46.99,90.17 180 top
CONN2  39.37,90.17 180 top
CONN3  54.61,90.17 180 top
CONN4  31.75,90.17 180 top
D1  11.43,13.97 90 top
D2  3.81,13.97 270 top
D3  7.62,13.97 270 top
D4  15.24,13.97 90 top
F1  13.97,43.18 0 top
IC1  29.21,13.97 0 top
IC2  35.56,25.4 0 top
IC3  57.15,25.4 0 top
IC4  57.15,13.97 0 top
IC5  68.58,54.61 0 top
IC6  68.58,83.82 0 top
IC7  22.86,39.37 180 top
JP1  78.74,55.88 270 top
JP2  78.74,85.09 270 top
LED1  60.96,8.89 0 top
LED2  30.48,36.83 270 top
LED3  33.02,36.83 270 top
R1  53.34,8.89 180 top
R2  60.96,47.75 180 top
R3  60.96,54.61 90 top
R4  75.69,54.61 270 top
R5  60.96,76.96 180 top
R6  60.96,83.82 90 top
R7  75.44,83.82 270 top
R8  30.48,41.91 90 top
R9  33.02,41.91 90 top
R10  49.53,94.36 90 top
R11  44.45,94.36 90 top
R12  41.91,94.36 90 top
R13  36.83,94.36 90 top
R14  57.15,94.36 90 top
R15  52.07,94.36 90 top
R16  34.29,94.36 90 top
R17  29.21,94.36 90 top
T1  10.16,5.08 90 top
U1  67.31,39.37 0 top
U2  67.31,68.58 0 top
U$7  27.94,67.31 180 top
U$8  45.72,36.83 90 top
X1  5.08,39.37 0 top

### Tracks (layer width: path | path; a pad name or v marks a point on that pad's centre or on a via)
3.3V  (via drill 0.51)  (1 unrouted)
  Top 0.254: IC4.OUT 69.85,13.97 | 69.85,13.97 C6.1 | U1.14 59.69,41.91 60.2,41.15 64.26,41.15 64.77,41.91 U1.12 U1.11 67.31,41.91 68.58,40.64 68.58,34.29 69.85,33.02 76.2,33.02 | U2.14 59.69,71.12 60.96,69.85 63.5,69.85 64.77,71.12 U2.12 U2.11 67.31,71.12 68.58,69.85 68.58,63.5 69.85,62.23 76.2,62.23 77.47,60.96 v77.47,36.83 | 76.2,33.02 v77.47,34.29 | 69.85,13.97 73.66,13.97 74.93,15.24 74.93,29.21 | 74.93,29.21 74.93,31.75 76.2,33.02 | C16.1 24.94,78.62 U$7.44 24.94,74.22 24.51,73.79 24.51,71.63 | U$7.34 29.94,79.12 C15.1 29.92,74.12 29.46,73.66 29.46,72.9 | C11.1 39.49,67.81 U$7.14 34.81,67.81 34.42,68.2 32.51,68.2 31.5,67.18 | C12.1 39.51,62.81 U$7.4 34.85,62.81 34.42,63.25 32.26,63.25 31.5,62.48 | C14.1 U$7.83 25.44,60.54 24.51,61.47 | C9.1 U$7.54 21.15,71.81 21.72,71.25 23.75,71.25 24.51,70.48 | C8.1 16.49,66.81 U$7.64 21.2,66.81 21.72,66.29 23.88,66.29 24.51,65.66 | C7.1 16.48,61.81 U$7.74 21.25,61.81 21.72,61.34 24.38,61.34 24.51,61.47 | 24.51,71.63 24.51,70.48 | 24.51,70.48 24.51,65.66 | 24.51,65.66 24.51,61.47 | 31.5,61.09 30.94,60.53 U$7.94 30.94,53.76 C13.1 | 31.5,67.18 31.5,70.87 | 31.5,62.48 31.5,67.18 | 31.5,61.09 31.5,62.48 | 31.5,70.87 29.46,72.9 | 29.46,72.9 28.96,72.39 25.27,72.39 24.51,71.63 | 31.5,70.87 33.78,73.15 34.42,73.15 34.76,72.81 U$7.24 38.48,72.81 C10.1 | U$8.2 41.91,38.1 40.64,36.83 40.64,31.75 41.91,30.48 53.34,30.48 | 53.34,30.48 73.66,30.48 74.93,29.21 | R17.2 R16.2 R13.2 R12.2 R11.2 R10.2 R15.2 R14.2 | 53.34,30.48 52.07,31.75 52.07,45.72 50.8,46.99 48.26,46.99 34.29,60.96 31.62,60.96 31.5,61.09
  Bottom 0.254: v77.47,34.29 v77.47,36.83
5V
  Top 0.254: R1.2 51.94,11.3 IC4.IN 54.61,17.78 59.69,22.86 IC3.OUT 66.04,25.4 C5.1
12V  (via drill 0.51)
  Top 0.254: IC3.IN 48.26,25.4 43.18,20.32 | 80.01,34.29 78.74,35.56 U1.7 74.93,38.1 73.66,39.37 73.66,46.99 72.39,48.26 69.85,48.26 68.58,49.53 v68.58,53.34 | 80.01,34.29 80.01,63.5 78.74,64.77 U2.7 74.93,67.31 73.66,68.58 73.66,76.2 72.39,77.47 69.85,77.47 68.58,78.74 v68.58,82.55 | 43.18,20.32 C4.1 48.26,11.43 48.26,8.89 50.8,6.35 77.47,6.35 80.01,8.89 80.01,34.29 | 43.18,20.32 IC2.OUT
  Bottom 0.254: IC6.8 64.77,86.36 v68.58,82.55 | IC5.8 64.77,57.15 v68.58,53.34
-12V
  Top 0.254: C3.2 36.83,8.89 IC1.OUT
  Bottom 0.254: C3.2 48.26,8.89 50.8,6.35 77.47,6.35 80.01,8.89 80.01,31.75 | 80.01,31.75 78.74,33.02 71.12,33.02 69.85,34.29 U1.5 | IC5.4 74.93,48.26 78.74,48.26 80.01,46.99 | 80.01,31.75 80.01,46.99 | U2.5 69.85,63.5 71.12,62.23 78.74,62.23 80.01,60.96 | 80.01,46.99 80.01,60.96 | IC6.4 74.93,77.47 77.47,77.47 80.01,74.93 80.01,60.96
AMPA  (1 unrouted)
  Top 0.254: CONN1.1 R10.1 | U$7.27 33.44,76.37 34.29,77.22
AMPB  (1 unrouted)
  Top 0.254: CONN1.3 R11.1 | U$7.28 32.94,76.63 33.78,77.47 33.78,81.03
DACA  (via drill 0.51)
  Top 0.254: v66.04,39.37 63.75,39.37 62.99,40.13 58.93,40.13 57.15,41.91 v57.15,44.45 | U$7.97 32.44,57.48 45.47,44.45 v50.8,44.45
  Bottom 0.254: U1.8 74.93,41.91 73.66,40.64 67.31,40.64 v66.04,39.37 | v50.8,44.45 v57.15,44.45
DACB  (via drill 0.51)
  Top 0.254: v66.04,68.58 59.69,68.58 v58.42,67.31 | U$7.7 50.34,64.31 50.8,64.77 v50.8,67.31
  Bottom 0.254: U2.8 74.93,71.12 73.66,69.85 67.31,69.85 v66.04,68.58 | v50.8,67.31 v58.42,67.31
FREQA  (1 unrouted)
  Top 0.254: CONN2.1 R12.1 | U$7.29 32.44,76.89 33.27,77.72 33.27,81.03
FREQB  (1 unrouted)
  Top 0.254: CONN2.3 R13.1 | U$7.30 31.94,77.15 32.77,77.98 32.77,81.28
GND  (via drill 0.51)
  Top 0.254: LED1.C 62.46,8.66 60.96,11.43 58.42,11.43 57.15,12.7 IC4.GND | R4.2 v75.69,50.8 | v75.44,80.01 R7.2 | C17.2 C19.C v12.57,34.93 v12.57,34.92 | IC7.21 22.54,33.58 v22.35,33.4 | IC7.18 20.59,34.55 v20.32,34.29 | X1.GND 8.59,37.77 v9.53,36.83 | IC7.26 25.79,37.72 v25.4,38.1 25.14,37.84 IC7.25 | IC7.7 23.18,40.97 v22.86,40.64 | C15.2 29.92,82.12 v29.97,82.17 | C16.2 24.94,81.61 v24.89,82.17 | U$7.33 30.44,73.57 v30.48,73.53 | U$7.23 34.21,72.31 v34.16,72.26 | C11.2 42.52,67.79 v42.55,67.82 | C14.2 25.43,52.22 v25.4,52.2 | C9.2 13.51,71.81 v13.46,71.75 | C8.2 13.49,66.83 v13.46,66.8 | C7.2 13.49,61.82 v13.46,61.85 | U$7.43 25.44,73.57 v25.4,73.53 | U$7.53 21.8,72.31 v21.84,72.26 | U$7.63 v21.84,67.31 | U$7.73 21.8,62.31 v21.84,62.36 | U$7.84 25.94,61.18 v25.91,61.21 | U$7.93 30.44,61.17 v30.48,61.21 | v34.16,67.31 U$7.13 | U$7.3 34.21,62.31 v34.16,62.36 | C12.2 42.05,60.06 v42.16,59.94 | C10.2 40.55,75.09 v40.77,75.31 | C13.2 33.21,52.26 v32.77,51.82
  pour Bottom: 1.27,5.08 1.27,93.98 2.54,99.06 128.27,99.06 133.35,95.25 133.35,5.08 129.54,1.27 5.08,1.27
MISO
  Top 0.254: U$8.1 44.45,36.83 44.45,39.37 43.18,40.64 40.13,40.64 28.44,52.33 U$7.89
N$1
  Top 0.254: D1.A D4.A 15.24,20.32 C1.2 26.67,16.51 IC1.IN
N$2
  Top 0.254: D2.A 3.81,6.35 T1.SEC1 6.35,5.08 10.16,8.89 D1.C
N$3
  Top 0.254: T1.SEC3 D4.C 12.7,11.43 10.16,11.43 D3.A
N$4
  Top 0.254: D2.C D3.C C2.1 10.16,26.67 31.75,26.67 IC2.IN
N$5
  Top 0.254: X1.VBUS 9.22,40.97 11.43,43.18 F1.1
N$6
  Top 0.254: R1.1 LED1.A
N$7
  Top 0.254: U1.9 72.39,45.72 71.12,46.99 68.58,46.99 67.31,48.26 IC5.2
N$8
  Top 0.254: U1.6 72.39,38.1 68.58,41.91 68.58,44.45 67.31,45.72 60.96,45.72 59.56,47.12 R2.2 59.56,50.67 60.96,52.07 R3.1 63.37,53.21 64.77,54.61 68.58,54.61 69.85,55.88 IC5.6
N$9
  Top 0.254: U1.10 69.85,44.45 64.77,49.53 IC5.1 64.77,48.26 64.26,47.75 R2.1
N$10
  Top 0.254: IC6.2 67.31,77.47 68.58,76.2 71.12,76.2 72.39,74.93 U2.9
N$11
  Top 0.254: U2.10 69.85,73.66 64.77,78.74 IC6.1 64.77,77.47 64.26,76.96 R5.1
N$13  (via drill 0.51)
  Top 0.254: IC5.7 67.31,59.69 68.58,60.96 74.93,60.96 v76.2,59.69
  Bottom 0.254: JP1.1 78.74,57.15 v76.2,59.69
N$14
  Top 0.254: R4.1 75.69,57.66 74.93,58.42 IC5.5
N$15
  Top 0.254: U2.6 72.39,67.31 68.58,71.12 68.58,73.66 67.31,74.93 60.96,74.93 59.56,76.33 R5.2 59.56,79.88 60.96,81.28 R6.1 61.09,82.55 63.5,82.55 64.77,83.82 68.58,83.82 69.85,85.09 IC6.6
N$17
  Top 0.254: IC6.7 67.31,88.9 68.58,90.17 73.66,90.17 JP2.1
N$18
  Top 0.254: R7.1 75.44,87.12 74.93,87.63 IC6.5
N$19
  Top 0.254: X1.D- 8.98,40.17 11.05,38.1 11.05,34.16 11.43,33.78 16,33.78 17.78,35.56 17.78,36.83 18.16,37.21 18.8,37.21 19.29,36.72 IC7.16
N$20
  Top 0.254: X1.D+ 8.89,39.37 10.41,37.85 10.41,34.04 11.43,33.02 16.51,33.02 18.64,35.15 IC7.15
N$21
  Top 0.254: F1.2 C17.1 C19.A 16.51,36.83 17.78,38.1 20.32,38.1 21.89,36.53 | 21.89,36.53 IC7.20 | R9.2 R8.2 30.48,43.18 26.67,39.37 24.13,39.37 21.89,37.12 21.89,36.53
N$22
  Top 0.254: LED2.A R8.1
N$23
  Top 0.254: LED3.A R9.1
N$24
  Top 0.254: IC7.23 23.84,34.33 24.38,33.78 29.84,33.78 30.48,34.42 LED2.C
N$25
  Top 0.254: LED3.C 33.02,34.29 31.75,33.02 24.13,33.02 23.18,33.97 IC7.22
N$31
  Top 0.254: 32,58.67 32,57.15 34.04,55.12
N$32
  Top 0.254: 31.5,58.67 31.5,56.9 33.78,54.61
OFFA  (1 unrouted)
  Top 0.254: CONN3.1 R14.1 | U$7.25 36.99,73.31 37.59,73.91 37.59,75.69 38.1,76.2
OFFB  (1 unrouted)
  Top 0.254: CONN3.3 R15.1 | U$7.26 33.94,76.1 34.54,76.71
PHASEA  (1 unrouted)
  Top 0.254: CONN4.1 R16.1 | U$7.31 31.44,77.41 32.26,78.23 32.26,81.79
PHASEB  (1 unrouted)
  Top 0.254: CONN4.3 R17.1 | U$7.32 30.94,77.68 31.75,78.49 31.75,81.79
RST
  Top 0.254: U$8.5 46.99,36.83 46.99,40.64 45.72,41.91 39.62,41.91 28.94,52.59 U$7.90
RXD
  Top 0.254: IC7.1 27.09,44.54 25.15,46.48 3.3,46.48 2.54,47.24 2.54,82.55 3.81,83.82 8.38,83.82 18.89,73.31 U$7.51
SPI-DACA-CS  (via drill 0.51)
  Top 0.254: U1.1 55.88,35.56 53.34,38.1 v53.34,73.66 | U$7.18 41.11,69.81 46.23,74.93 v49.53,74.93
  Bottom 0.254: v53.34,73.66 52.07,73.66 50.8,74.93 v49.53,74.93
SPI-DACB-CS  (via drill 0.51)
  Top 0.254: U$7.19 40.85,70.31 46.99,76.45 50.55,76.45 52.07,74.93 v52.07,64.77
  Bottom 0.254: v52.07,64.77 U2.1
SPI-MISO
  Top 0.254: U2.13 59.69,74.93 58.42,74.93 57.15,73.66 | U1.13 59.69,45.72 58.42,45.72 57.15,46.99 57.15,73.66 | U$7.21 40.32,71.31 46.74,77.72 55.88,77.72 57.15,76.45 57.15,73.66
SPI-MOSI  (via drill 0.51)
  Top 0.254: U2.3 60.96,60.96 v59.69,60.96 | U1.3 64.77,36.83 62.23,39.37 57.15,39.37 55.88,40.64 v55.88,60.96 55.88,76.2 54.86,77.22 46.99,77.22 40.58,70.81 U$7.20
  Bottom 0.254: v55.88,60.96 v59.69,60.96
SPI-SCK  (via drill 0.51)
  Top 0.254: U2.2 59.69,62.23 v58.42,62.23 | U1.2 59.69,38.1 57.15,38.1 54.61,40.64 v54.61,62.23 v54.61,74.93 | U$7.22 40.06,71.81 46.99,78.74 v54.61,78.74
  Bottom 0.254: v54.61,62.23 v58.42,62.23 | v54.61,74.93 v54.61,78.74
TXD  (via drill 0.51)
  Top 0.254: IC7.5 24.48,44.09 22.86,45.72 3.05,45.72 1.78,46.99 1.78,83.06 v2.54,83.82 | U$7.52 18.63,72.81 8.89,82.55 v7.62,82.55
  Bottom 0.254: v2.54,83.82 3.81,82.55 v7.62,82.55

### Text on the board
tPlace: CH-B | CH-A | TX | RX | PWR | A | CTR | B